# EAGLE design SensorBoard (EAGLE 9.4.1)
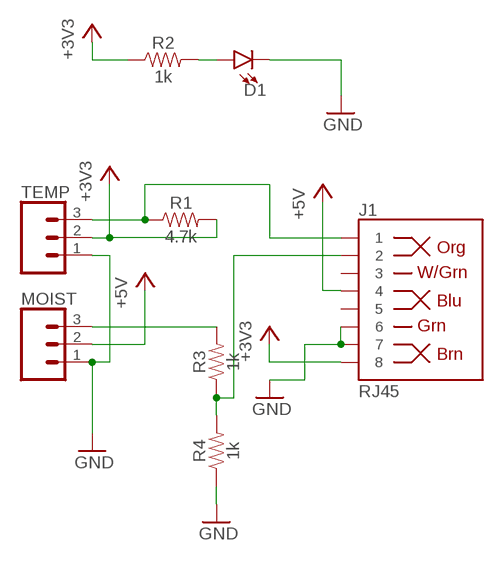
[diagram p0: schematic, sheet 1]

## Parts
D1  LED3MM  [LED_3MM]
J1  RJ45  RJ45-8  [RJ45-8]
MOIST  CONN_03  [1X03]
R1  4.7k  1KOHM-HORIZ-1/4W-1%  [AXIAL-0.3]
R2  1k  1KOHM-HORIZ-1/4W-1%  [AXIAL-0.3]
R3  1k  1KOHM-HORIZ-1/4W-1%  [AXIAL-0.3]
R4  1k  1KOHM-HORIZ-1/4W-1%  [AXIAL-0.3]
TEMP  CONN_03  [1X03]

## Nets
+3V3: J1.8 R1.P$2 R2.P$1 TEMP.2
+5V: J1.4 MOIST.2
GND: D1.K(C) J1.6 J1.7 MOIST.1 R4.P$1 TEMP.1
N$1: J1.2 R3.P$1 R4.P$2
N$2: MOIST.3 R3.P$2
N$3: D1.A R2.P$2
N$4: J1.1 R1.P$1 TEMP.3
Unconnected: J1.3 J1.5

## Library data of the parts
D1 = SparkFun-LED:LED: LED (Generic) Standard schematic elements and footprints for 5mm, 3mm, 1206, and 0603 sized LEDs. Generic LEDs with no color specified.; PROD_ID: DIO-08794
J1 = SparkFun-Connectors:RJ45-8: RJ45 Jack - 8 pin Simple RJ45, 8-pin connection. Commonly used for Cat5, Cat5e, and Cat6 Ethernet cables. Here is the connector we sell at SparkFun: RJ45 8-Pin Connector <https://www.sparkfun.com/products/643> (PRT-00643) Datasheet <https://cdn.sparkfun.com/datasheets/Prototyping/04908.pdf> It is used on this SparkFun product: SparkFun RJ45 Breakout <https://www.sparkfun.com/products/716> (BOB-00716) Note, you may also be interested in the "MAGJACK" version of this. It is basically a RJ45 connector, but also has some status LEDs built into the connector housing. You can check that out in this library at the device named "MAGJACK.dev" and see these products online: RJ45 Ethernet MagJack-Compatible <https://www.sparkfun.com/products/8534> (PRT-08534) SparkFun RJ45 MagJack Breakout <https://www.sparkfun.com/products/13021> (BOB-13021); PROD_ID: CONN-08506; SF_ID: PRT-00643
MOIST TEMP = SparkFun-Connectors:CONN_03: Multi connection point. Often used as Generic Header-pin footprint for 0.1 inch spaced/style header connections On any of the 0.1 inch spaced packages, you can populate with these: Break Away Headers - Straight <https://www.sparkfun.com/products/116> (PRT-00116) Break Away Male Headers - Right Angle <https://www.sparkfun.com/products/553> (PRT-00553) Female Headers <https://www.sparkfun.com/products/115> (PRT-00115) Break Away Headers - Machine Pin <https://www.sparkfun.com/products/117> (PRT-00117) Break Away Female Headers - Swiss Machine Pin <https://www.sparkfun.com/products/743> (PRT-00743) Stackable Header - 3 Pin (Female, 0.1") <https://www.sparkfun.com/products/13875> (PRT-13875) For SCREWTERMINALS and SPRING TERMINALS visit here: Screw Terimnals on SparkFun.com <https://www.sparkfun.com/search/results?term=Screw+Terminals> (5mm/3.5mm/2.54mm spacing) This device is also useful as a general connection point to wire up your design to another part of your project. Our various solder wires solder well into these plated through hole pads. Hook-Up Wire - Assortment (Stranded, 22 AWG) <https://www.sparkfun.com/products/11375> (PRT-11375) Hook-Up Wire - Assortment (Solid Core, 22 AWG) <https://www.sparkfun.com/products/11367> (PRT-11367) View the entire wire category on our website here <https://www.sparkfun.com/categories/141> Special notes: Molex polarized connector foot print use with SKU : PRT-08232 with associated crimp pins and housings.
R1 = SparkFun-Resistors:1KOHM: 1kΩ resistor A resistor is a passive two-terminal electrical component that implements electrical resistance as a circuit element. Resistors act to reduce current flow, and, at the same time, act to lower voltage levels within circuits. - Wikipedia; PROD_ID: RES-12182; VALUE: 1k
R2-R4 = SparkFun-Resistors:1KOHM: 1kΩ resistor A resistor is a passive two-terminal electrical component that implements electrical resistance as a circuit element. Resistors act to reduce current flow, and, at the same time, act to lower voltage levels within circuits. - Wikipedia; PROD_ID: RES-12182

## Board
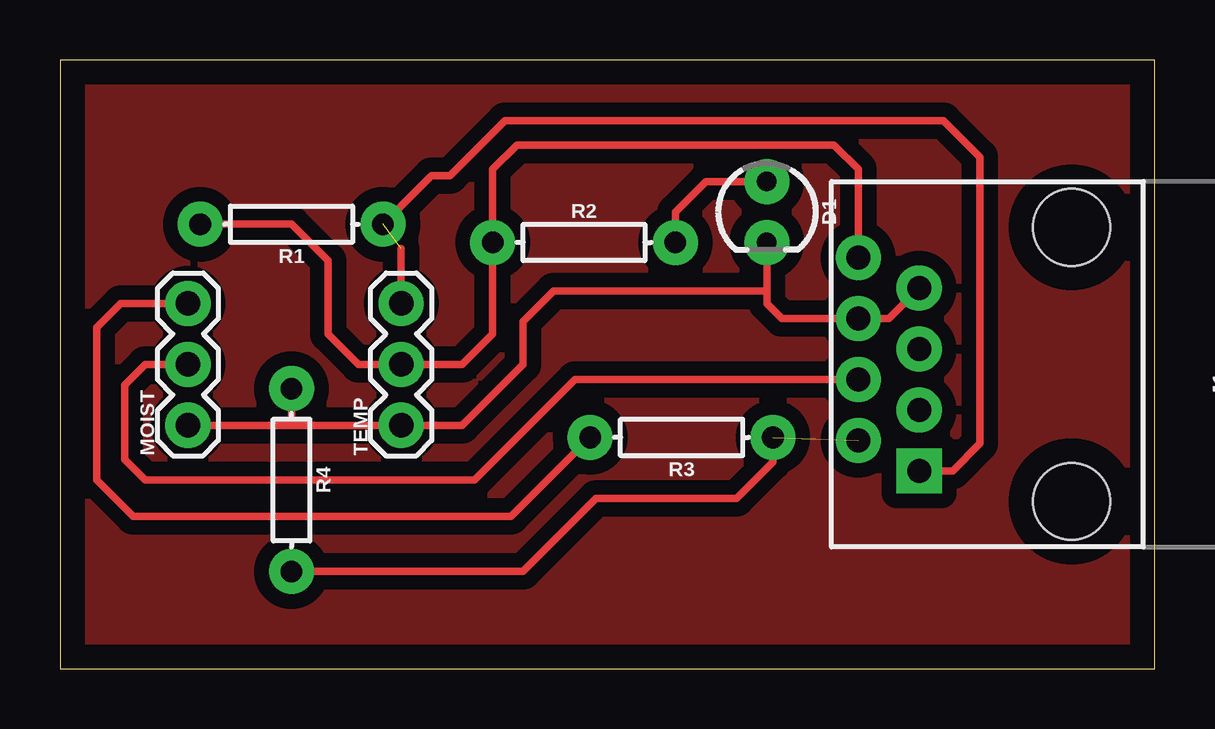
[diagram p1: board, top side]
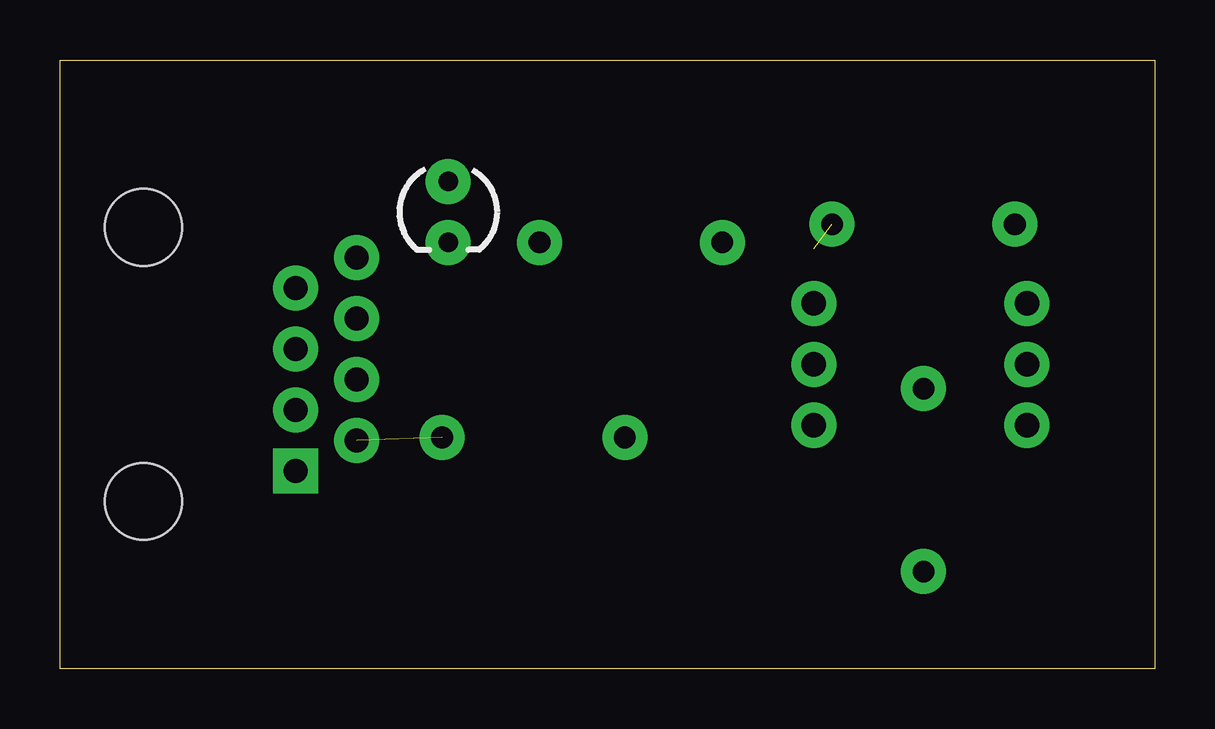
[diagram p2: board, bottom side, seen from below]

Size 45.64 x 25.39 mm. Coordinates in mm from the lower left corner, seen from the top.
Outline: 0,0 45.64,0 45.64,25.39 0,25.39 0,0
Copper layers (1*16): Top 0.035mm / dielectric 1.5mm / Bottom 0.035mm
Design rules "default": minimum track width 6mil, minimum drill 0.35mm, track to track 6mil, track to pad 6mil, pad to pad 6mil, via to via 6mil, smd to smd 6mil, copper to edge 40mil, drill to drill 6mil, minimum pad ring 10mil, minimum via ring 8mil, stop-mask expansion 4mil, vias tented up to drill 0mil, thermal gap 10mil

### Footprints (pad centres in the part's own frame; a part is rotated, then mirrored left to right if it is on the bottom)
LED_3MM = drill 0.813 pad 1.88: A -1.27,0; K 1.27,0
RJ45-8 = drill 1 pad 1.88 square: 1 -4.445,6.35 | drill 1 pad 1.88: 2 -3.175,8.89; 3 -1.905,6.35; 4 -0.635,8.89; 5 0.635,6.35; 6 1.905,8.89; 7 3.175,6.35; 8 4.445,8.89 | hole 3.2: -5.715,0; 5.715,0
1X03 = drill 1.016 pad 1.88: 1 0,0; 2 2.54,0; 3 5.08,0
AXIAL-0.3 = drill 0.9 pad 1.88: P$1 -3.81,0; P$2 3.81,0

### Placement (x,y rotation side)
D1  29.46,19.05 270 top
J1  42.16,12.7 90 top
MOIST  5.33,10.16 90 top
R1  9.65,18.54 180 top
R2  21.84,17.78 0 top
R3  25.91,9.65 180 top
R4  9.65,7.87 270 top
TEMP  14.22,10.16 90 top

### Tracks (layer width: path | path; a pad name or v marks a point on that pad's centre or on a via)
+3V3
  Top 0.305: J1.8 33.27,20.83 32.26,21.84 19.05,21.84 18.03,20.83 R2.P$1 18.03,13.97 16.76,12.7 14.48,12.7 TEMP.2 12.45,12.7 11.18,13.97 11.18,17.02 9.65,18.54 R1.P$2
+5V
  Top 0.305: J1.4 21.46,12.06 17.27,7.87 3.56,7.87 2.69,8.74 2.69,11.84 3.56,12.7 MOIST.2
GND
  Top 0.305: J1.7 34.54,14.6 J1.6 30.1,14.6 29.46,15.24 29.46,15.75 | 29.46,15.75 D1.K | 29.46,15.75 20.57,15.75 19.3,14.48 19.3,12.7 16.76,10.16 TEMP.1 9.65,10.16 | MOIST.1 9.65,10.16 | 9.65,10.16 R4.P$1
N$1  (1 unrouted)
  Top 0.305: R4.P$2 19.3,4.06 22.35,7.11 28.19,7.11 29.72,8.64 R3.P$1
N$2
  Top 0.305: MOIST.3 2.54,15.24 1.52,14.22 1.52,7.87 3.05,6.35 18.8,6.35 R3.P$2
N$3
  Top 0.305: R2.P$2 25.65,19.05 26.92,20.32 D1.A
N$4  (1 unrouted)
  Top 0.305: R1.P$1 15.49,20.57 16.26,20.57 18.54,22.86 36.83,22.86 38.35,21.34 38.35,9.4 37.21,8.26 J1.1 | TEMP.3 14.22,17.53
NEW
  pour Top (isolate 0.61): 0,25.4 45.72,25.4 45.72,0 0,0